# EAGLE design budapest_rev_A (EAGLE 6.6.0)
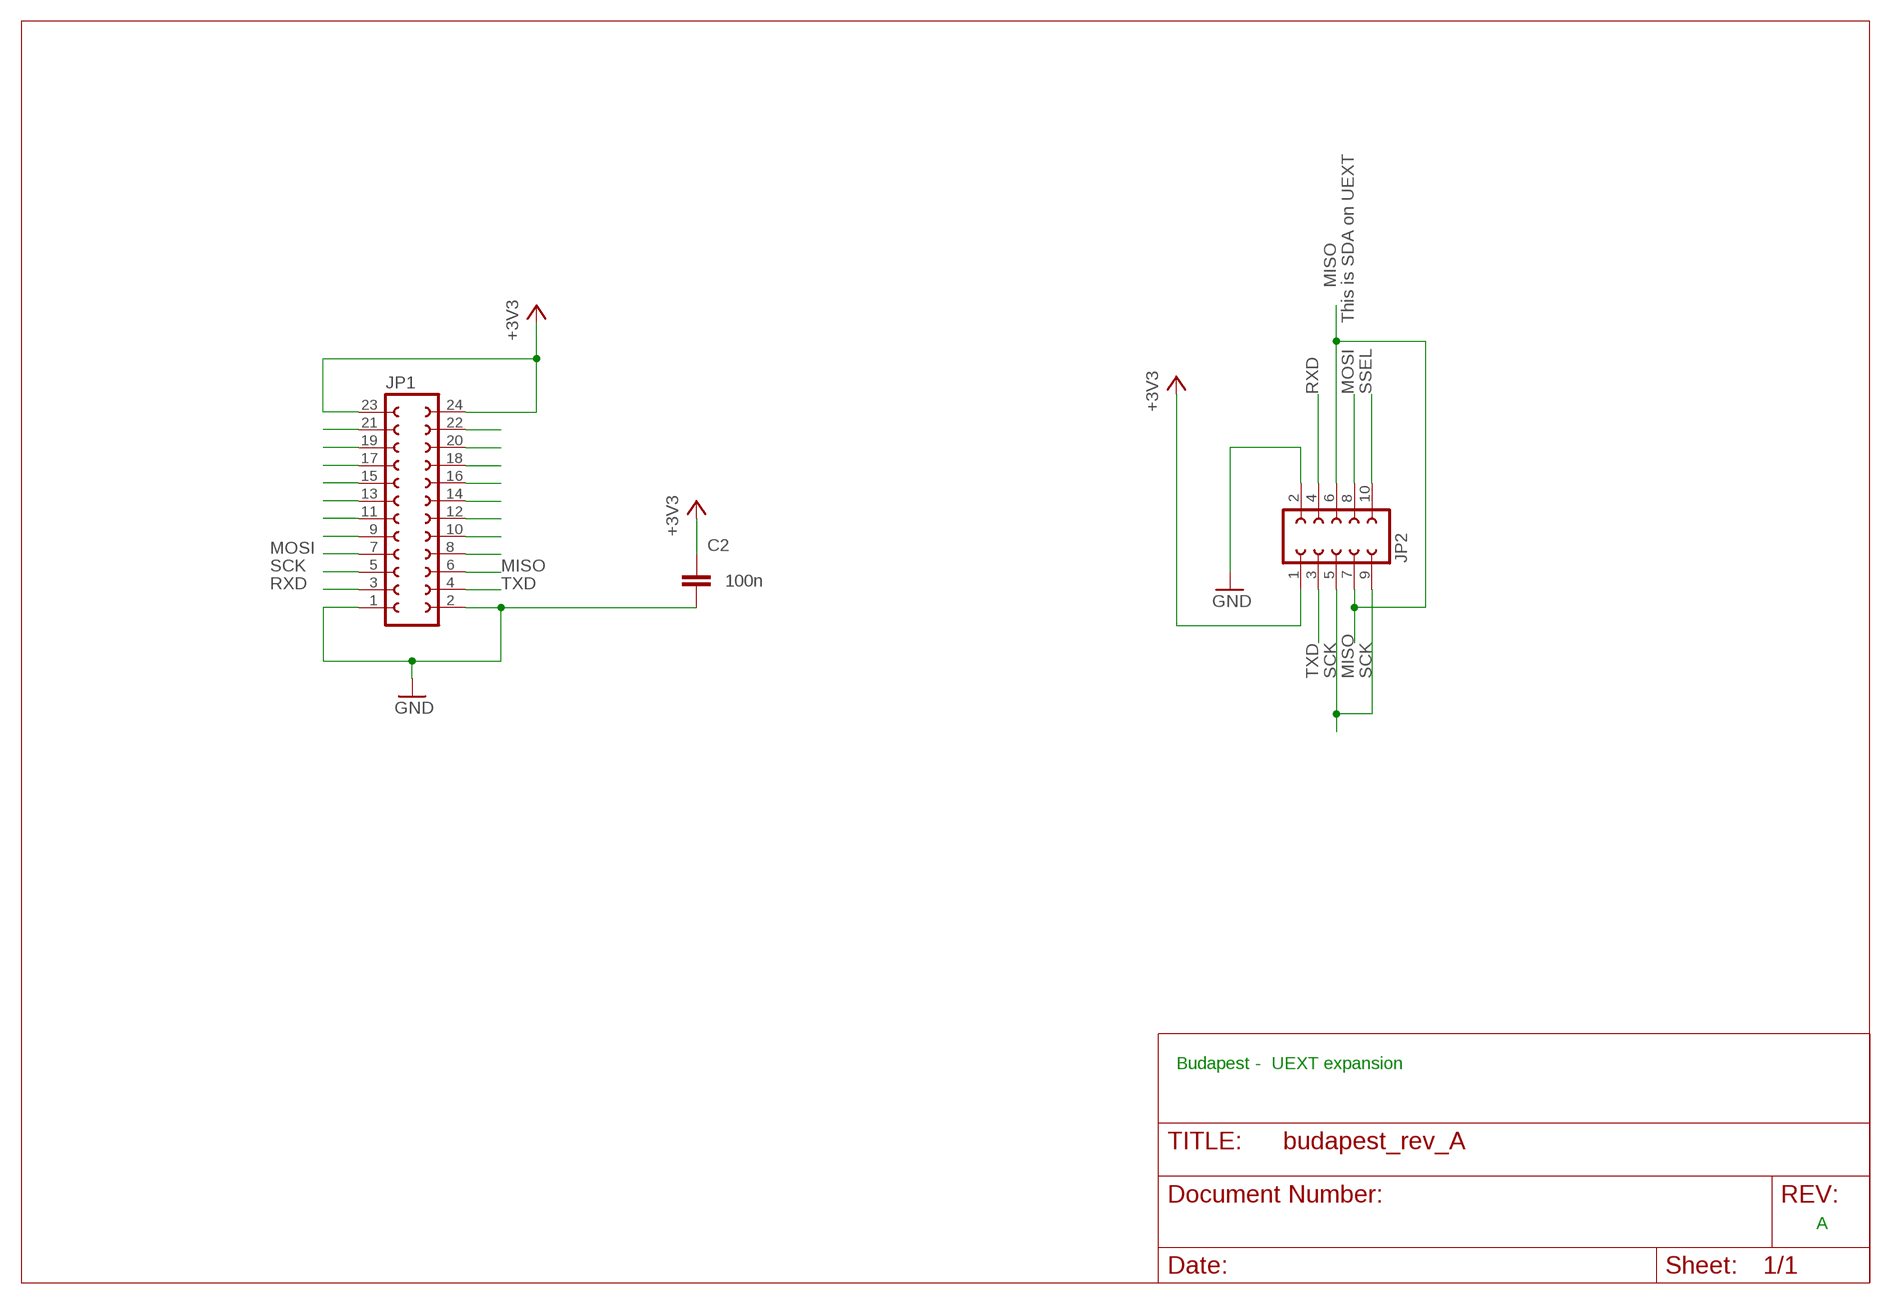
[diagram p0: schematic, sheet 1]

## Parts
C2  100n  C-EUC0805  [C0805]
JP1  FE12-2  [FE12-2]
JP2  FE05-2  [FE05-2]

## Nets
+3V3: C2.1 JP1.23 JP1.24 JP2.1
GND: C2.2 JP1.1 JP1.2 JP2.2
MISO: JP1.6 JP2.6 JP2.7
MOSI: JP1.7 JP2.8
N$1: JP1.18
N$2: JP1.14
N$9: JP1.22
N$10: JP1.20
N$12: JP1.16
N$14: JP1.12
N$15: JP1.10
N$16: JP1.8
N$21: JP1.21
N$22: JP1.19
N$23: JP1.17
N$24: JP1.15
N$25: JP1.13
N$26: JP1.11
N$27: JP1.9
RXD: JP1.3 JP2.4
SCK: JP1.5 JP2.5 JP2.9
SSEL: JP2.10
TXD: JP1.4 JP2.3

## Notes on the sheet
- This is SDA on UEXT
- Budapest -  UEXT expansion
- A

## Library data of the parts
C2 = rcl:C-EU: CAPACITOR, European symbol
JP1 = con-lsta:FE12-2: FEMALE HEADER; OC_FARNELL: unknown; OC_NEWARK: unknown
JP2 = con-lsta:FE05-2: FEMALE HEADER; OC_FARNELL: unknown; OC_NEWARK: unknown

## Board
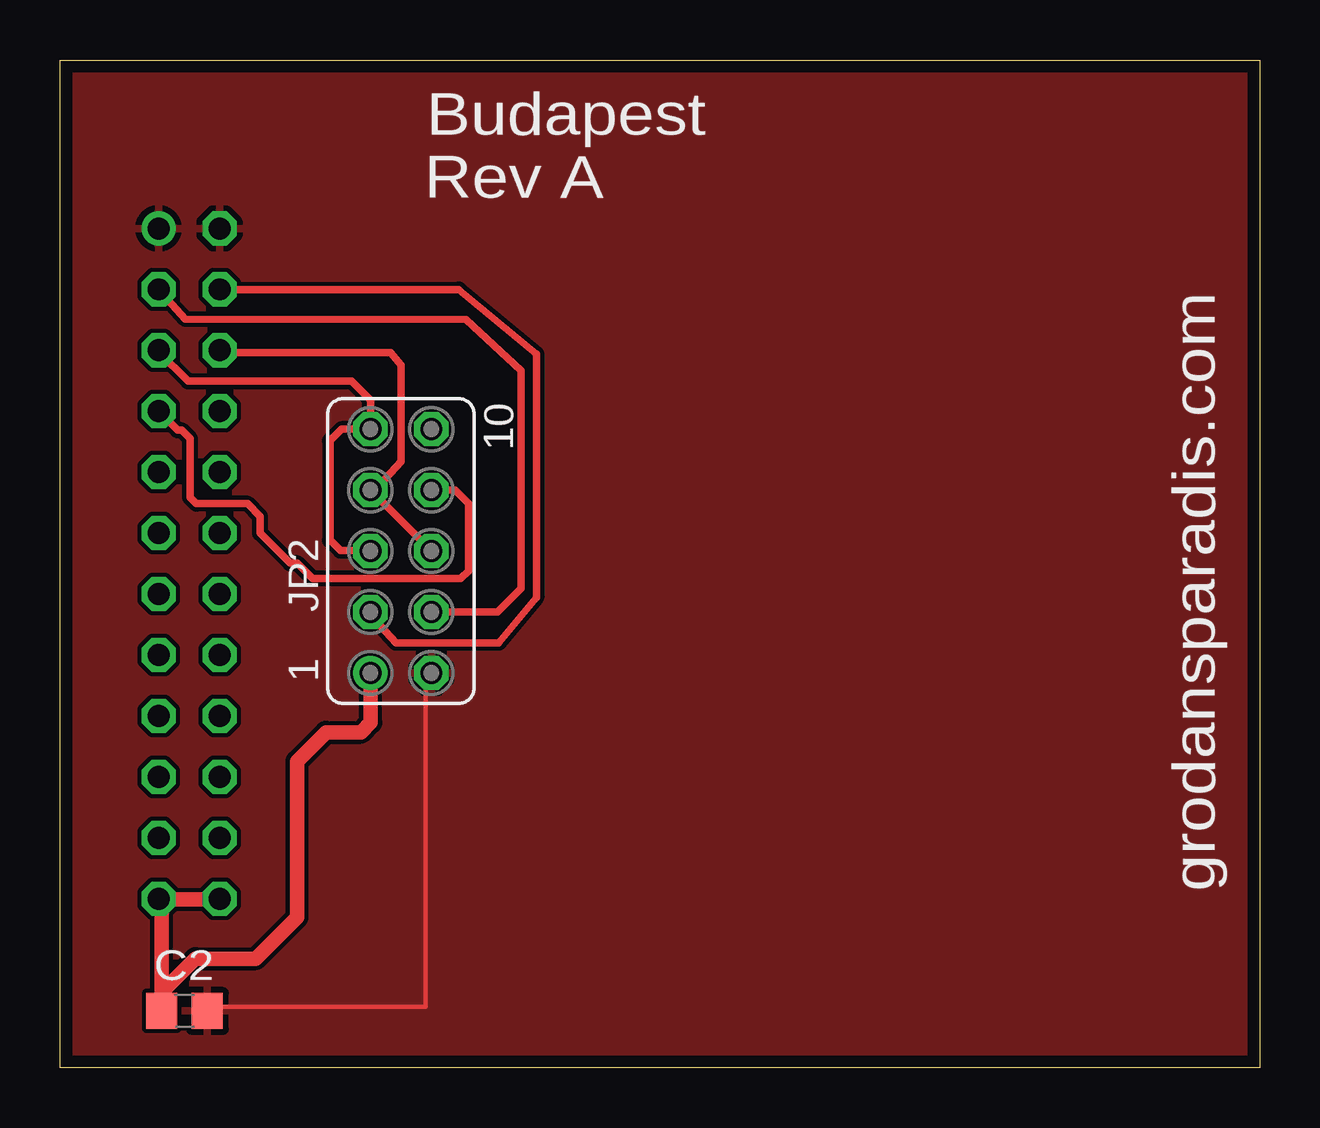
[diagram p1: board, top side]
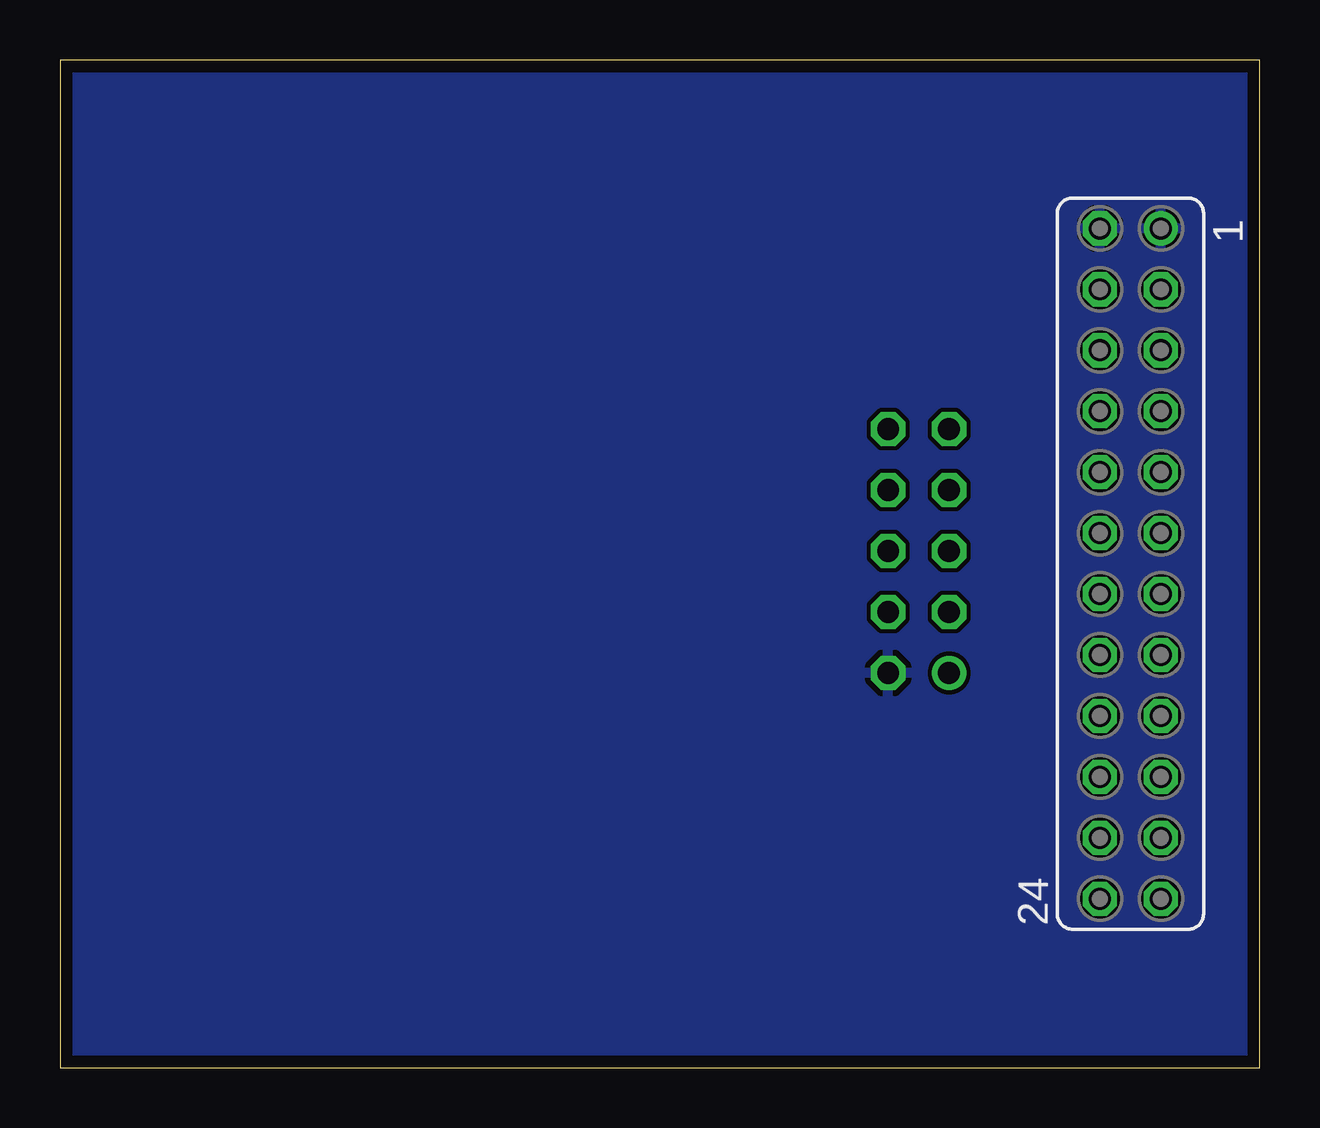
[diagram p2: board, bottom side, seen from below]

Size 50 x 42 mm. Coordinates in mm from the lower left corner, seen from the top.
Outline: 0,0 0,42 50,42 50,0 0,0
Copper layers (1*16): Top 0.0356mm / dielectric 1.5011mm / Bottom 0.0356mm
Design rules "SilverCircuits": minimum track width 7mil, minimum drill 14mil, track to track 7mil, track to pad 7mil, pad to pad 7mil, via to via 7mil, smd to smd 0mil, copper to edge 20mil, drill to drill 8mil, minimum pad ring 10mil, minimum via ring 8mil, stop-mask expansion 4mil, vias tented up to drill 0mil, thermal gap 10mil

### Footprints (pad centres in the part's own frame; a part is rotated, then mirrored left to right if it is on the bottom)
C0805 = smd 1.3 x 1.5: 1 -0.95,0; 2 0.95,0
FE12-2 = drill 0.914: 1 -13.97,1.27 | drill 0.914 octagon: 2 -13.97,-1.27; 3 -11.43,1.27; 4 -11.43,-1.27; 5 -8.89,1.27; 6 -8.89,-1.27; 7 -6.35,1.27; 8 -6.35,-1.27; 9 -3.81,1.27; 10 -3.81,-1.27; 11 -1.27,1.27; 12 -1.27,-1.27; 13 1.27,1.27; 14 1.27,-1.27; 15 3.81,1.27; 16 3.81,-1.27; 17 6.35,1.27; 18 6.35,-1.27; 19 8.89,1.27; 20 8.89,-1.27; 21 11.43,1.27; 22 11.43,-1.27; 23 13.97,1.27; 24 13.97,-1.27
FE05-2 = drill 0.914: 1 -5.08,1.27 | drill 0.914 octagon: 2 -5.08,-1.27; 3 -2.54,1.27; 4 -2.54,-1.27; 5 0,1.27; 6 0,-1.27; 7 2.54,1.27; 8 2.54,-1.27; 9 5.08,1.27; 10 5.08,-1.27

### Placement (x,y rotation side)
C2  5.19,2.36 0 top
JP1  5.38,21.01 270 bottom
JP2  14.21,21.53 90 top

### Tracks (layer width: path | path; a pad name or v marks a point on that pad's centre or on a via)
+3V3
  Top 0.406: 4.24,7.04 JP1.23 4.12,7 | 6.67,7 JP1.24
  Top 0.61: 4.24,7.04 C2.1 4.24,3.14 5.64,4.54 8.16,4.54 9.88,6.26 9.88,12.77 11.09,13.98 12.55,13.98 12.95,14.38 JP2.1 | 4.12,7 6.67,7
GND
  Top 0.178: C2.2 6.35,2.54 15.24,2.54 15.24,16.51 JP2.2
  pour Bottom: 0.28,41.29 0.25,41.29 0.25,0.08 34.33,0.39 35.37,0.54 49.98,0.14 49.98,42.04 0.51,42.07 0.51,40.95
  pour Top: -0.42,42.22 50.73,42.22 50.73,-0.36 -0.54,-0.36 -0.54,26.92
MISO
  Top 0.305: JP2.6 JP2.7 13.13,24.07 14.23,25.25 14.23,29.28 13.79,29.8 6.75,29.8 JP1.6
MOSI
  Top 0.305: JP2.8 16.46,24.07 17.02,23.5 17.02,20.7 16.7,20.38 10.52,20.38 9.88,21.02 9.59,21.02 8.34,22.28 8.34,22.98 7.81,23.5 5.68,23.5 5.42,23.77 5.42,26.21 5.07,26.57 4.9,26.57 JP1.7
RXD
  Top 0.305: JP2.4 18.24,18.99 19.23,19.98 19.23,29.06 16.93,31.18 5.22,31.2 JP1.3
SCK
  Top 0.305: JP2.5 12.92,21.55 11.69,21.55 11.25,21.99 11.25,26.13 11.73,26.61 JP2.9 12.94,27.82 12.16,28.61 5.33,28.61 4.11,29.83 JP1.5
TXD
  Top 0.305: JP1.4 16.62,32.44 19.86,29.74 19.86,19.6 18.29,17.7 14.01,17.7 13.35,18.42 13.35,18.58 JP2.3

### Text on the board
tNames: Budapest | Rev A | grodansparadis.com